# EasyEDA Pro project EasyEDA_Pro_SMD_3128_BM_3.epro, board CPLD_Cart_PCB
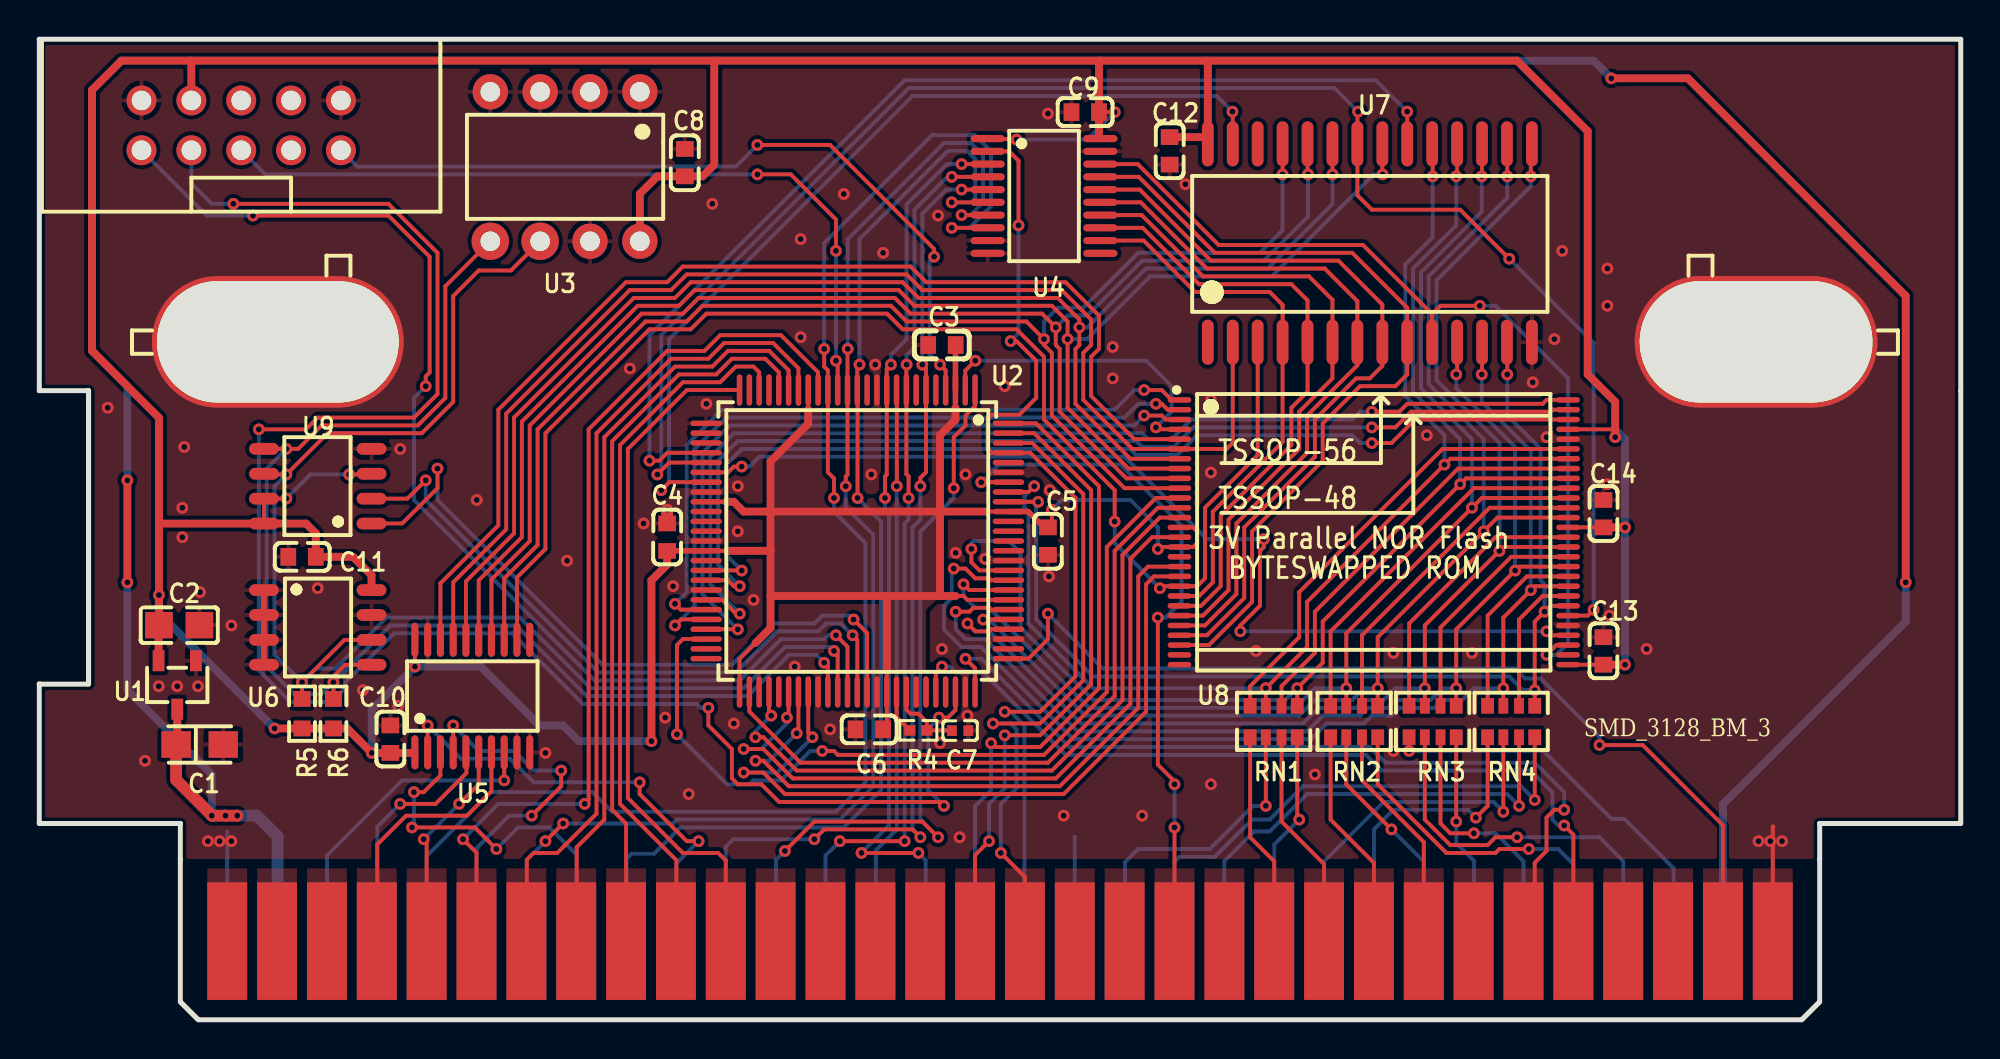
[diagram p1: board, top side]
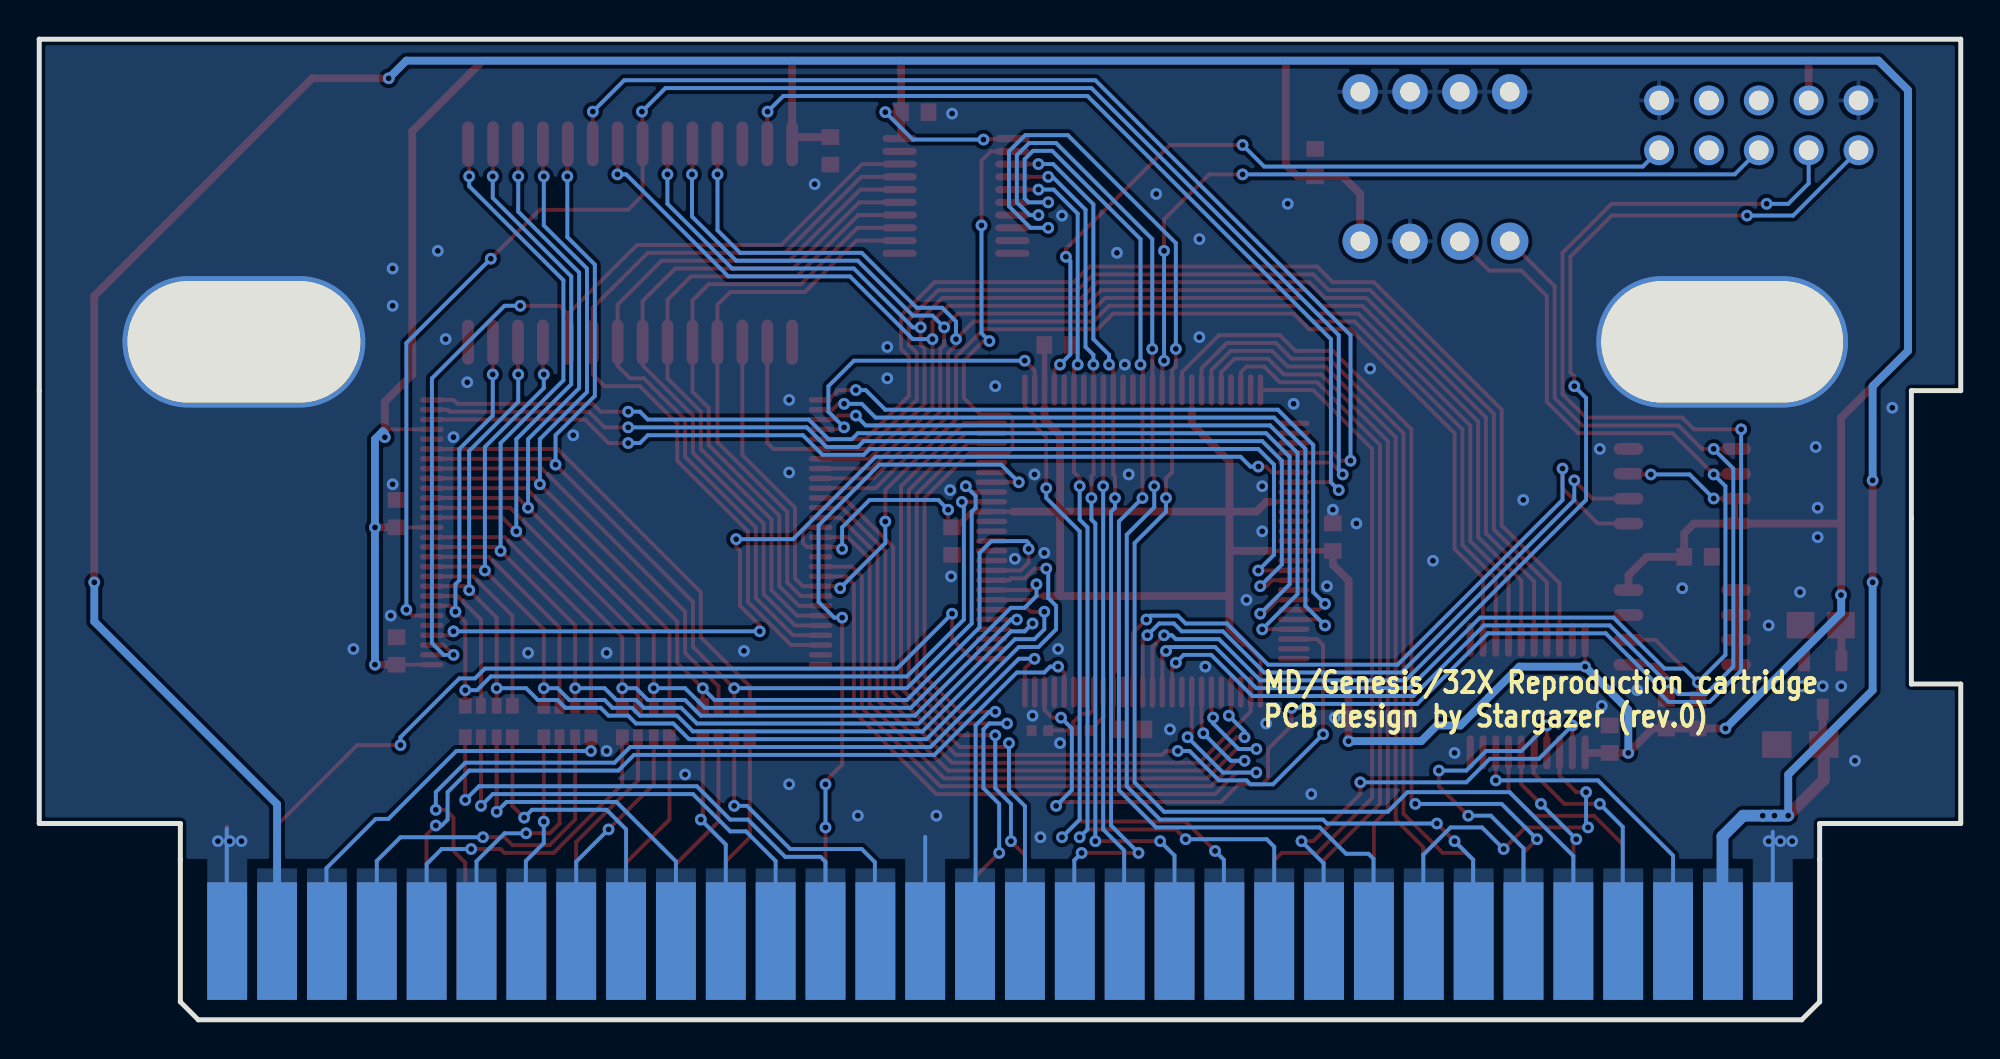
[diagram p2: board, bottom side, seen from below]

Outline 97.89 x 50 mm; copper layers: Top Layer, Bottom Layer. Coordinates in mm from the lower left corner of the outline.
Outline path: 7.19,8.18 7.19,10.01 0,10.01 0,17.12 2.51,17.12 2.51,32.08 0,32.08 0,50 97.89,50 97.89,10.01 90.7,10.01 90.7,8.18
Stack: Top Layer 0.035mm / Dielectric1 1.51mm FR4 er 4.5 / Bottom Layer 0.035mm

## Design rules (mm)
template: Custom Config
spacing copperThickness1oz (default): track to track 0.102, other pairs 0.152 to 0.3
spacing copperThickness2oz: track to track 0.203, other pairs 0.152 to 0.3
track width copperThickness1oz (default): min 0.127, default 0.254, max 2.54
track width copperThickness2oz: min 0.203, default 0.254, max 2.54
differential pair differentialPair (default): width min 0.127, default 0.254, max 2.54; gap min 0.152, default 0.152
via viaSize (default): diameter min 0.5, default 0.61, max 10; hole min 0.3, default 0.305, max 6.3
pour e3051 uses copperRegion

## Placement (name value [footprint] x y rotation side)
C1  10uF  [CASE-A_3216]  8.17 14.04 0 top
C2  1uF  [C0805]  7.13 20.12 180 top
C3  100nF  [C0603]  45.99 34.41 0 top
C4  100nF  [C0603]  31.99 24.61 270 top
C5  100nF  [C0603]  51.39 24.41 90 top
C6  100nF  [C0603]  42.29 14.81 0 top
C7  220pF  [C0402]  46.91 14.75 180 top
C8  100nF  [C0603]  32.89 43.71 90 top
C9  100nF  [C0603]  53.29 46.28 0 top
C10  100nF  [C0603]  17.89 14.31 270 top
C11  100nF  [C0603]  13.39 23.61 180 top
C12  100nF  [C0603]  57.59 44.31 270 top
C13  100nF  [C0603]  79.69 18.81 270 top
C14  100nF  [C0603]  79.69 25.81 270 top
CN1  JTAG  [IDC-TH_10P-P2.54_C5665]  10.29 45.61 0 top
CON1  EDGE CONNECTOR  [SEGA GENESIS CARTRIDGE EDGE CONNETOR]  7.19 8.18 0 top
NOREF  -  [Pad_e3007]  12.15 34.57 0 top
NOREF#2  -  [Pad_e3006]  87.47 34.57 0 top
R4  330Ω  [R0402]  44.79 14.76 0 top
R5  4.7kΩ  [R0603]  13.39 15.61 270 top
R6  4.7kΩ  [R0603]  14.99 15.61 270 top
RN1  100Ω  [RES-ARRAY-SMD_0603-8P-L3.2-W1.6-BL]  62.89 15.21 0 top
RN2  100Ω  [RES-ARRAY-SMD_0603-8P-L3.2-W1.6-BL]  66.99 15.21 0 top
RN3  100Ω  [RES-ARRAY-SMD_0603-8P-L3.2-W1.6-BL]  70.99 15.21 0 top
RN4  100Ω  [RES-ARRAY-SMD_0603-8P-L3.2-W1.6-BL]  74.99 15.21 0 top
U1  XC6206P332MR  [SOT-23-3_L2.9-W1.6-P1.90-LS2.8-BR]  7.03 17.07 90 top
U2  EPM3128ATC100  [TQFP-100_L14.0-W14.0-P0.50-LS16.0-BL]  41.68 24.41 180 top
U3  24CXX (DIP)  [PDIP-8_L9.6-W6.4-P2.54-LS7.6-BL]  26.79 43.51 180 top
U4  74LVC245  [TSSOP-20_L6.5-W4.4-P0.65-LS6.4-BL]  51.19 42.01 270 top
U5  74LVC245  [TSSOP-20_L6.5-W4.4-P0.65-LS6.4-BL]  22.06 16.51 0 top
U6  24C(SO)  [SOIC-8_L5.0-W4.0-P1.27-LS6.0-TL]  14.19 20.01 0 top
U7  FM16W08  [SOIC-28_L18.0-W7.5-P1.27-LS10.3-BL]  67.79 39.61 0 top
U8  S29GL01GT10TFI020  [TSOP-56_L14.1-W18.5-P0.50-LS20.2-BL]  67.99 24.86 270 top
U9  M95XXX  [SOIC-8_L5.0-W4.0-P1.27-LS6.0-TL]  14.19 27.21 180 top

## Footprints (pads in the part's own frame, mm; a bottom-side part is the same pattern mirrored in y, then rotated)
C0402
  rect 0.5x0.54 smd: 1(-0.42,0) 2(0.42,0)
C0603
  rect 0.8x0.9 smd: 1(-0.7,0) 2(0.7,0)
C0805
  rect 1.41x1.35 smd: 1(-1.03,0) 2(1.03,0)
CASE-A_3216
  rect 1.5x1.359 smd: 1(-1.2,0) 2(1.2,0)
IDC-TH_10P-P2.54_C5665
  round 1.524 hole 1: 1(-5.08,-1.27) 2(-5.08,1.27) 3(-2.54,-1.27) 4(-2.54,1.27) 5(0,-1.27) 6(0,1.27) 7(2.54,-1.27) 8(2.54,1.27) 9(5.08,-1.27) 10(5.08,1.27)
Pad_e3006
  oval 12.37x6.705 hole 11.862x6.197: 2(0,0)
Pad_e3007
  oval 12.827x6.705 hole 12.319x6.197: 2(0,0)
PDIP-8_L9.6-W6.4-P2.54-LS7.6-BL
  round 1.8 hole 1: 1(-3.81,-3.81) 2(-1.27,-3.81) 3(1.27,-3.81) 4(3.81,-3.81) 7(-1.27,3.81) 8(-3.81,3.81)
  round 1.905 hole 1: 5(3.81,3.81) 6(1.27,3.81)
R0402
  rect 0.566x0.54 smd: 1(-0.433,0) 2(0.433,0)
R0603
  rect 0.806x0.864 smd: 1(-0.753,0) 2(0.753,0)
RES-ARRAY-SMD_0603-8P-L3.2-W1.6-BL
  rect 0.65x0.8 smd: 1(-1.2,-0.8) 4(1.2,-0.8) 5(1.2,0.8) 8(-1.2,0.8)
  rect 0.5x0.8 smd: 2(-0.4,-0.8) 3(0.4,-0.8) 6(0.4,0.8) 7(-0.4,0.8)
SEGA GENESIS CARTRIDGE EDGE CONNETOR
  custom 2.032x5.995 smd far side: A1(2.388,-3.81) A2(4.928,-3.81) A3(7.468,-3.81) A4(10.008,-3.81) A5(12.547,-3.81) A6(15.088,-3.81) A7(17.628,-3.81) A8(20.168,-3.81) A9(22.707,-3.81) A10(25.247,-3.81) A11(27.788,-3.81) A12(30.328,-3.81) A13(32.867,-3.81) A14(35.407,-3.81) A15(37.947,-3.81) A16(40.487,-3.81) A17(43.028,-3.81) A18(45.568,-3.81) A19(48.108,-3.81) A20(50.648,-3.81) A21(53.188,-3.81) A22(55.727,-3.81) A23(58.267,-3.81) A24(60.807,-3.81) A25(63.347,-3.81) A26(65.888,-3.81) A27(68.427,-3.81) A28(70.968,-3.81) A29(73.507,-3.81) A30(76.047,-3.81) A31(78.588,-3.81) A32(81.127,-3.81)
  custom 2.032x5.995 smd: B1(2.388,-3.81) B2(4.928,-3.81) B3(7.468,-3.81) B4(10.008,-3.81) B5(12.547,-3.81) B6(15.088,-3.81) B7(17.628,-3.81) B8(20.168,-3.81) B9(22.707,-3.81) B10(25.247,-3.81) B11(27.788,-3.81) B12(30.328,-3.81) B13(32.867,-3.81) B14(35.407,-3.81) B15(37.947,-3.81) B16(40.487,-3.81) B17(43.028,-3.81) B18(45.568,-3.81) B19(48.108,-3.81) B20(50.648,-3.81) B21(53.188,-3.81) B22(55.727,-3.81) B23(58.267,-3.81) B24(60.807,-3.81) B25(63.347,-3.81) B26(65.888,-3.81) B27(68.427,-3.81) B28(70.968,-3.81) B29(73.507,-3.81) B30(76.047,-3.81) B31(78.588,-3.81) B32(81.127,-3.81)
SOIC-8_L5.0-W4.0-P1.27-LS6.0-TL
  oval 1.52x0.6 smd: 1(-2.74,1.905) 2(-2.74,0.635) 3(-2.74,-0.635) 4(-2.74,-1.905) 5(2.74,-1.905) 6(2.74,-0.635) 7(2.74,0.635) 8(2.74,1.905)
SOIC-28_L18.0-W7.5-P1.27-LS10.3-BL
  oval 0.6x2.3 smd: 1(-8.255,-5.058) 2(-6.985,-5.058) 3(-5.715,-5.058) 4(-4.445,-5.058) 5(-3.175,-5.058) 6(-1.905,-5.058) 7(-0.635,-5.058) 8(0.635,-5.058) 9(1.905,-5.058) 10(3.175,-5.058) 11(4.445,-5.058) 12(5.715,-5.058) 13(6.985,-5.058) 14(8.255,-5.058) 15(8.255,5.058) 16(6.985,5.058) 17(5.715,5.058) 18(4.445,5.058) 19(3.175,5.058) 20(1.905,5.058) 21(0.635,5.058) 22(-0.635,5.058) 23(-1.905,5.058) 24(-3.175,5.058) 25(-4.445,5.058) 26(-5.715,5.058) 27(-6.985,5.058) 28(-8.255,5.058)
SOT-23-3_L2.9-W1.6-P1.90-LS2.8-BR
  rect 1.07x0.6 smd: 1(1.235,-0.95) 2(1.235,0.95) 3(-1.235,0)
TQFP-100_L14.0-W14.0-P0.50-LS16.0-BL
  oval 0.28x1.6 smd: 1(-6,-7.7) 2(-5.5,-7.7) 3(-5,-7.7) 4(-4.5,-7.7) 5(-4,-7.7) 6(-3.5,-7.7) 7(-3,-7.7) 8(-2.5,-7.7) 9(-2,-7.7) 10(-1.5,-7.7) 11(-1,-7.7) 12(-0.5,-7.7) 13(0,-7.7) 14(0.5,-7.7) 15(1,-7.7) 16(1.5,-7.7) 17(2,-7.7) 18(2.5,-7.7) 19(3,-7.7) 20(3.5,-7.7) 21(4,-7.7) 22(4.5,-7.7) 23(5,-7.7) 24(5.5,-7.7) 25(6,-7.7) 51(6,7.7) 52(5.5,7.7) 53(5,7.7) 54(4.5,7.7) 55(4,7.7) 56(3.5,7.7) 57(3,7.7) 58(2.5,7.7) 59(2,7.7) 60(1.5,7.7) 61(1,7.7) 62(0.5,7.7) 63(0,7.7) 64(-0.5,7.7) 65(-1,7.7) 66(-1.5,7.7) 67(-2,7.7) 68(-2.5,7.7) 69(-3,7.7) 70(-3.5,7.7) 71(-4,7.7) 72(-4.5,7.7) 73(-5,7.7) 74(-5.5,7.7) 75(-6,7.7)
  oval 1.6x0.28 smd: 26(7.7,-6) 27(7.7,-5.5) 28(7.7,-5) 29(7.7,-4.5) 30(7.7,-4) 31(7.7,-3.5) 32(7.7,-3) 33(7.7,-2.5) 34(7.7,-2) 35(7.7,-1.5) 36(7.7,-1) 37(7.7,-0.5) 38(7.7,0) 39(7.7,0.5) 40(7.7,1) 41(7.7,1.5) 42(7.7,2) 43(7.7,2.5) 44(7.7,3) 45(7.7,3.5) 46(7.7,4) 47(7.7,4.5) 48(7.7,5) 49(7.7,5.5) 50(7.7,6) 76(-7.7,6) 77(-7.7,5.5) 78(-7.7,5) 79(-7.7,4.5) 80(-7.7,4) 81(-7.7,3.5) 82(-7.7,3) 83(-7.7,2.5) 84(-7.7,2) 85(-7.7,1.5) 86(-7.7,1) 87(-7.7,0.5) 88(-7.7,0) 89(-7.7,-0.5) 90(-7.7,-1) 91(-7.7,-1.5) 92(-7.7,-2) 93(-7.7,-2.5) 94(-7.7,-3) 95(-7.7,-3.5) 96(-7.7,-4) 97(-7.7,-4.5) 98(-7.7,-5) 99(-7.7,-5.5) 100(-7.7,-6)
TSOP-56_L14.1-W18.5-P0.50-LS20.2-BL
  oval 0.28x1.2 smd: 1(-6.75,-9.9) 2(-6.25,-9.9) 3(-5.75,-9.9) 4(-5.25,-9.9) 5(-4.75,-9.9) 6(-4.25,-9.9) 7(-3.75,-9.9) 8(-3.25,-9.9) 9(-2.75,-9.9) 10(-2.25,-9.9) 11(-1.75,-9.9) 12(-1.25,-9.9) 13(-0.75,-9.9) 14(-0.25,-9.9) 15(0.25,-9.9) 16(0.75,-9.9) 17(1.25,-9.9) 18(1.75,-9.9) 19(2.25,-9.9) 20(2.75,-9.9) 21(3.25,-9.9) 22(3.75,-9.9) 23(4.25,-9.9) 24(4.75,-9.9) 25(5.25,-9.9) 26(5.75,-9.9) 27(6.25,-9.9) 28(6.75,-9.9) 29(6.75,9.9) 30(6.25,9.9) 31(5.75,9.9) 32(5.25,9.9) 33(4.75,9.9) 34(4.25,9.9) 35(3.75,9.9) 36(3.25,9.9) 37(2.75,9.9) 38(2.25,9.9) 39(1.75,9.9) 40(1.25,9.9) 41(0.75,9.9) 42(0.25,9.9) 43(-0.25,9.9) 44(-0.75,9.9) 45(-1.25,9.9) 46(-1.75,9.9) 47(-2.25,9.9) 48(-2.75,9.9) 49(-3.25,9.9) 50(-3.75,9.9) 51(-4.25,9.9) 52(-4.75,9.9) 53(-5.25,9.9) 54(-5.75,9.9) 55(-6.25,9.9) 56(-6.75,9.9)
TSSOP-20_L6.5-W4.4-P0.65-LS6.4-BL
  oval 0.364x1.742 smd: 1(-2.925,-2.871) 2(-2.275,-2.871) 3(-1.625,-2.871) 4(-0.975,-2.871) 5(-0.325,-2.871) 6(0.325,-2.871) 7(0.975,-2.871) 8(1.625,-2.871) 9(2.275,-2.871) 10(2.925,-2.871) 11(2.925,2.871) 12(2.275,2.871) 13(1.625,2.871) 14(0.975,2.871) 15(0.325,2.871) 16(-0.325,2.871) 17(-0.975,2.871) 18(-1.625,2.871) 19(-2.275,2.871) 20(-2.925,2.871)

## Nets
As in the schematic, except:
GND: C1.2 C2.1 C3.1 C4.1 C5.1 C6.1 C7.1 C8.2 C9.1 C10.1 C11.2 C12.2 C13.1 C14.1 CN1.2 CN1.10 CON1.A1 CON1.A18 CON1.A32 CON1.B32 NOREF.2 NOREF#2.2 U1.1 U2.11 U2.26 U2.33 U2.38 U2.43 U2.53 U2.59 U2.65 U2.74 U2.78 U2.86 U2.95 U3.1 U3.2 U3.3 U3.4 U3.7 U4.9 U4.10 U4.19 U5.9 U5.10 U5.19 U6.1 U6.2 U6.3 U6.4 U6.7 U7.14 U8.33 U8.52 U9.4

Pads without a net: CN1 6 7 8; CON1 B1 B2 B3 B12 B13 B14 B15 B18 B19 B21 B26 B29 B30; U2 5 7 12 22 24 27 28 35 36 37 40 49 50 55 69 70 72 77 87 88 89 90 96; U4 11; U5 11; U7 1 26; U8 17 27 28 30

## Via types
v1: diameter 0.6, hole 0.3, Top Layer to Bottom Layer, 278 vias

## Routing (per net, layer and track width the routed paths; a pad name or vN(x,y) marks a point on that pad's centre or on a via; arc(x,y) is an arc through that point)
+3V3: length 330
  Top Layer w0.2: U2.82 47.28,21.41 47.09,21.61 46.69,21.61 ; U9.3 16.89,27.81 v1(15.79,27.81) ; v1(49.79,44.88) 49.76,44.91 48.32,44.91 ; 35.04,23.91 U2.39 ; C6.2 43.18,15 U2.66 43.18,17.8 ; U2.51 35.68,18.4 36.49,19.21 ; U2.18 39.18,31.11 ; U8.53 80.19,30.11 80.29,30.01 ; U9.8 U9.7 12.58,26.57 v1(12.59,26.58) ; U2.91 48.29,25.91 ; v1(51.59,26.01) 51.59,25.31 C5.2 ; U8.43 C14.2 ; U8.14 58.79,25.11 58.99,24.91 58.99,24.31 58.79,24.11 U8.16 57.09,24.11 v1(56.99,24.01) ; U5.20 v1(19.14,18.01) ; 34.99,26.41 U2.34 ; U2.3 46.68,31.21 ; C9.2 v1(54.79,46.28) ; U8.29 C13.2
  Top Layer w0.28: U2.3 46.68,34.4 C3.2 ; U2.91 50.38,25.91 51.19,25.11 C5.2 ; U2.39 31.99,23.91 C4.2
  Top Layer w0.4: 46.69,21.61 45.89,21.61 ; 45.89,21.61 45.89,25.91 ; 45.89,21.61 43.18,21.61 ; 46.68,31.21 46.68,30.6 45.89,29.81 45.89,25.91 ; v1(80.29,29.71) 80.29,31.51 78.89,32.91 78.89,45.31 75.29,48.91 59.53,48.91 ; v1(31.19,14.21) 31.19,22.41 31.99,23.21 C4.2 ; v1(80.79,18.11) C13.2 ; C12.1 59.53,45.01 ; 59.53,45.01 59.53,48.91 ; 59.53,45.01 U7.28 ; 37.26,21.61 37.26,23.91 ; 37.26,21.61 37.26,19.98 36.49,19.21 ; 37.26,21.61 43.18,21.61 ; 37.26,23.91 37.26,25.91 ; 37.26,23.91 35.04,23.91 ; 7.75,48.91 CN1.4 ; 7.75,48.91 4.19,48.91 2.69,47.41 2.69,34.11 6.1,30.7 6.1,25.3 ; 7.75,48.91 34.39,48.91 ; 59.53,48.91 53.99,48.91 ; 45.89,25.91 48.29,25.91 ; 45.89,25.91 37.26,25.91 ; 6.1,25.3 v1(6.1,21.66) C2.2 ; 6.1,25.3 U9.8 13.59,25.3 14.09,24.81 C11.1 15.99,23.61 16.93,22.67 U6.8 ; 37.26,25.91 35.88,25.91 35.38,26.41 34.99,26.41 ; 37.26,25.91 37.26,28.48 39.18,30.4 39.18,31.11 ; 34.39,48.91 53.99,48.91 ; 34.39,48.91 34.39,43.61 33.79,43.01 C8.1 31.49,43.01 30.6,42.12 U3.8 ; 53.99,48.91 C9.2 53.99,44.98 ; v1(80.79,25.11) C14.2 ; 43.18,21.61 43.18,17.8 ; 19.11,13.61 C10.2 v1(16.94,13.61) 15.69,14.85 R6.2 R5.2 v1(11.99,14.85)
  Top Layer w0.406: C2.2 6.08,20.1 U1.2
  Bottom Layer w0.2: v1(54.79,46.28) 53.39,44.88 v1(49.79,44.88) ; v1(12.59,26.58) 13.81,27.81 v1(15.79,27.81) ; v1(51.59,26.01) 52.09,26.51 55.59,26.51 56.99,25.11 v1(56.99,24.01)
  Bottom Layer w0.4: v1(16.94,13.61) 16.94,15.81 v1(19.14,18.01) 22.49,18.01 25.49,15.01 26.69,15.01 27.49,14.21 v1(31.19,14.21) ; v1(80.29,29.71) 80.29,29.91 80.39,30.01 80.79,29.61 v1(80.79,25.11) v1(80.79,18.11) ; v1(11.99,14.85) 6.09,20.75 6.09,21.71
+5V: length 190.1
  Top Layer w0.4: v1(4.49,27.51) v1(4.49,22.31) ; v1(80.09,48.01) 83.99,48.01 95.09,36.91 v1(95.09,22.31)
  Top Layer w0.406: U1.3 7.03,14.09 6.97,14.04
  Top Layer w0.6: 6.97,14.04 6.97,12.24 8.8,10.41 v1(9.49,10.41) v1(10.09,10.41)
  Bottom Layer w0.4: v1(4.49,27.51) 4.49,32.31 2.69,34.11 2.69,47.41 4.19,48.91 79.19,48.91 v1(80.09,48.01) ; CON1.A31 85.78,11 95.09,20.31 v1(95.09,22.31) ; v1(8.79,10.41) 8.79,12.51 4.49,16.81 v1(4.49,22.31)
  Bottom Layer w0.6: 8.88,10.41 v1(9.49,10.41) v1(10.09,10.41) 11.09,10.41 12.14,9.35 12.14,4.39 CON1.A2
GND: length 25.6
  Top Layer w0.203: CON1.A32 88.32,9.84 88.34,9.86
  Top Layer w0.3: U6.1 U6.2 U6.3 U6.4
  Top Layer w0.6: v1(31.99,26.01) C4.1
  Bottom Layer w0.2: CON1.A18 52.76,9.33
  Bottom Layer w0.203: CON1.A32 88.34,4.39 88.34,9.74 ; CON1.A1 9.58,9.58
  vias: v1(3.49,31.21) v1(5.39,13.21) v1(6.09,17.01) v1(7.03,17.01) v1(7.29,26.11) v1(7.29,24.61) v1(7.39,29.21) v1(8.09,17.01) v1(8.19,21.81) v1(8.59,9.11) v1(9.19,9.11) v1(9.79,20.11) v1(9.79,9.11) v1(14.19,22.01) v1(16.49,16.81) v1(18.29,16.01) v1(18.39,29.11) v1(22.29,26.51) v1(25.79,13.61) v1(26.89,23.41) v1(30.09,33.21) v1(30.79,25.31) v1(31.89,15.41) v1(32.29,22.11) v1(33.09,11.51) v1(33.99,31.41) v1(34.29,41.61) v1(35.39,15.11) v1(35.59,27.21) v1(35.59,24.91) v1(36.39,21.41) v1(38.49,18.01) v1(38.79,39.81) v1(38.79,34.81) v1(40.29,14.81) v1(40.99,42.11) v1(42.39,27.81) v1(42.59,33.41) v1(42.99,39.11) v1(45.79,41.01) v1(45.89,14.11) v1(45.99,18.91) v1(46.69,23.81) v1(46.89,9.31) v1(47.19,27.81) v1(47.29,15.51) v1(48.19,23.51) v1(49.19,32.31) v1(51.39,46.21) v1(51.44,22.61) v1(51.49,27.01) v1(52.19,10.41) v1(54.69,34.31) v1(54.69,32.71) v1(56.19,10.41) v1(58.39,42.61) v1(59.69,31.61) v1(59.69,27.91) v1(59.69,12.01) v1(61.99,18.81) v1(64.99,12.51) v1(68.99,18.71) v1(68.99,13.71) v1(70.69,29.81) v1(72.99,18.71) v1(76.09,32.51) v1(76.79,29.71) v1(77.19,34.71) v1(77.59,39.21) v1(79.89,38.31) v1(79.89,36.41) v1(79.89,27.31) v1(79.99,20.61) v1(81.89,18.91) v1(87.59,9.11) v1(88.19,9.11) v1(88.79,9.11)
A1: length 46.3
  Top Layer w0.2: 70.96,35.98 U7.10 ; 70.96,35.98 67.44,39.51 60.09,39.51 55.96,43.63 U4.18 ; 70.96,35.98 71.39,36.41 v1(73.39,36.41) ; U8.31 77.29,19.11 v1(76.79,18.61)
  Bottom Layer w0.2: v1(76.79,18.61) 77.29,18.61 77.89,19.21 77.89,32.71 74.19,36.41 v1(73.39,36.41)
A2: length 42.3
  Top Layer w0.2: U8.26 59.59,19.11 61.79,21.31 61.79,24.91 65.39,28.51 65.39,30.41 67.29,32.31 69.09,32.31 69.69,32.91 U7.9
  Top Layer w0.203: U7.9 69.69,36.3 66.89,39.11 59.89,39.11 56.01,42.98 U4.17
A3: length 39.2
  Top Layer w0.2: U7.8 68.42,33.34 67.79,32.71 67.09,32.71 64.99,30.61 64.99,28.71 61.39,25.11 61.39,21.51 59.49,19.61 U8.25
  Top Layer w0.203: U4.16 56.06,42.33 59.69,38.71 66.19,38.71 68.42,36.47 U7.8
A4: length 36.2
  Top Layer w0.2: U7.7 67.15,33.37 64.59,30.81 64.59,28.91 60.99,25.31 60.99,21.71 59.39,20.11 U8.24
  Top Layer w0.203: U4.15 56.11,41.68 59.49,38.31 65.49,38.31 67.15,36.64 U7.7
A5: length 33.7
  Top Layer w0.2: U8.23 59.29,20.61 60.59,21.91 60.59,25.51 64.19,29.11 64.19,31.01 65.88,32.7 U7.6
  Top Layer w0.203: U7.6 65.88,36.71 64.69,37.91 59.29,37.91 56.16,41.03 U4.14
A6: length 31
  Top Layer w0.2: U7.5 64.61,32.03 63.79,31.21 63.79,29.31 60.19,25.71 60.19,22.11 59.19,21.11 U8.22
  Top Layer w0.203: U4.13 56.21,40.38 59.09,37.51 63.79,37.51 64.61,36.68 U7.5
A7: length 28.3
  Top Layer w0.2: 63.34,36.45 62.69,37.11 58.89,37.11 56.26,39.73 U4.12 ; U8.21 59.09,21.61 59.79,22.31 59.79,25.91 63.34,29.46 U7.4
  Top Layer w0.203: 63.34,36.45 U7.4
A8: length 69.9
  Top Layer w0.2: U5.12 24.34,22.56 25.79,24.01 25.79,29.91 31.09,35.21 33.19,35.21 33.99,36.01 43.19,36.01 43.99,35.21 49.79,35.21 51.19,33.81 51.19,30.61 54.79,27.01 v1(54.79,25.41) ; v1(57.09,22.01) 57.19,22.11 U8.20 58.99,22.11 59.39,22.51 59.39,26.11 62.07,28.79 U7.3
  Bottom Layer w0.2: v1(57.09,22.01) 54.79,24.31 v1(54.79,25.41)
A9: length 72
  Top Layer w0.2: U7.25 63.34,43.11 v1(63.34,43.11) ; U8.10 55.29,27.11 51.59,30.81 51.59,34.01 51.19,34.41 v1(51.19,34.71) 50.29,35.61 44.19,35.61 43.39,36.41 33.79,36.41 32.99,35.61 30.89,35.61 25.39,30.11 25.39,24.21 23.69,22.51 U5.13
  Bottom Layer w0.2: v1(63.34,43.11) 63.34,40.26 62.19,39.11 55.99,39.11 53.19,36.31 51.89,36.31 51.19,35.61 v1(51.19,34.71)
A10: length 72.6
  Top Layer w0.2: v1(64.64,43.11) 64.61,43.13 U7.24 ; U5.14 23.04,22.46 24.99,24.41 24.99,30.31 30.69,36.01 32.79,36.01 33.59,36.81 43.59,36.81 44.39,36.01 51.09,36.01 v1(51.79,35.31) 51.79,34.41 51.99,34.21 51.99,31.01 55.39,27.61 U8.9
  Bottom Layer w0.2: v1(64.64,43.11) 64.64,40.96 62.39,38.71 56.19,38.71 53.39,35.91 52.39,35.91 v1(51.79,35.31)
A11: length 75.8
  Top Layer w0.2: U7.21 68.42,43.12 v1(68.44,43.11) ; U5.15 22.39,22.41 24.59,24.61 24.59,30.51 30.49,36.41 32.59,36.41 33.39,37.21 43.79,37.21 44.59,36.41 51.59,36.41 52.39,35.61 v1(52.39,34.71) 52.39,31.21 55.49,28.11 U8.8
  Bottom Layer w0.2: v1(68.44,43.11) 67.99,43.11 62.79,37.91 56.59,37.91 53.39,34.71 v1(52.39,34.71)
A12: length 74.2
  Top Layer w0.2: U8.7 55.59,28.61 52.79,31.41 52.79,34.21 52.99,34.41 v1(52.99,35.31) 52.99,35.71 51.89,36.81 44.79,36.81 43.99,37.61 33.19,37.61 32.39,36.81 30.29,36.81 24.19,30.71 24.19,24.81 21.74,22.36 U5.16 ; v1(65.89,43.11) 65.88,43.11 U7.23
  Bottom Layer w0.2: v1(52.99,35.31) 53.39,35.31 56.39,38.31 62.59,38.31 65.89,41.61 v1(65.89,43.11)
A13: length 64.5
  Top Layer w0.2: U5.17 21.09,22.31 23.79,25.01 23.79,30.91 30.09,37.21 32.19,37.21 32.99,38.01 44.19,38.01 44.99,37.21 52.09,37.21 53.59,35.71 53.59,34.41 53.19,34.01 53.19,31.61 55.69,29.11 U8.6 60.49,29.11 60.8,29.42 U7.2
A14: length 57.3
  Top Layer w0.2: U5.18 20.44,22.26 23.39,25.21 23.39,31.11 29.89,37.61 31.99,37.61 32.79,38.41 44.39,38.41 45.19,37.61 52.29,37.61 53.99,35.91 53.99,34.21 53.59,33.81 53.59,31.81 55.79,29.61 U8.5
D0: length 55.3
  Top Layer w0.2: v1(50.89,26.41) 50.88,26.41 U2.92 ; RN4.5 v1(76.19,16.81) 76.19,20.31 v1(76.69,20.81) 76.99,21.11 U8.35 ; U7.13 74.79,34.54 v1(74.79,32.91)
  Bottom Layer w0.2: v1(76.19,16.81) 75.59,16.81 74.89,17.51 53.69,17.51 50.79,20.41 50.79,26.31 v1(50.89,26.41) ; v1(74.79,32.91) 74.79,30.81 76.49,29.11 76.49,22.41 76.69,22.21 v1(76.69,20.81)
D1: length 60.4
  Top Layer w0.2: U8.37 76.19,22.11 v1(75.99,21.91) 74.59,20.51 v1(74.59,16.91) RN4.7 ; U2.84 48.48,22.41 48.39,22.51 47.69,22.51 47.19,23.01 v1(46.59,23.01) ; U7.12 73.5,32.92 v1(73.49,32.91)
  Bottom Layer w0.2: v1(74.59,16.91) 73.09,16.91 72.49,16.31 71.49,16.31 71.09,15.91 69.29,15.91 68.89,15.51 67.89,15.51 67.49,15.11 65.59,15.11 64.79,14.31 52.69,14.31 47.99,19.01 46.99,19.01 46.09,19.91 46.09,21.11 46.49,21.51 46.49,22.91 v1(46.59,23.01) ; v1(73.49,32.91) 73.49,31.51 75.99,29.01 v1(75.99,21.91)
D2: length 56.1
  Top Layer w0.2: U8.39 75.39,23.11 v1(75.19,22.91) 72.19,19.91 v1(72.19,16.91) RN3.5 ; v1(46.69,20.81) 47.39,20.81 47.59,21.01 48.39,21.01 48.48,20.91 U2.81 ; U7.11 72.23,32.95 v1(72.19,32.91)
  Bottom Layer w0.2: v1(72.19,32.91) 72.19,32.21 75.19,29.21 v1(75.19,22.91) ; v1(72.19,16.91) 71.49,16.91 70.89,16.31 69.09,16.31 68.69,15.91 67.69,15.91 67.29,15.51 65.39,15.51 64.59,14.71 52.89,14.71 48.19,19.41 47.19,19.41 46.69,19.91 v1(46.69,20.81)
D3: length 65.6
  Top Layer w0.2: U2.79 48.49,19.91 48.39,19.81 47.69,19.81 v1(47.29,20.21) ; v1(75.99,43.01) 75.99,44.61 U7.15 ; RN3.7 v1(70.59,16.91) 70.59,20.11 v1(74.39,23.91) 74.59,24.11 U8.41
  Bottom Layer w0.2: v1(74.39,23.91) 74.39,29.41 71.19,32.61 71.19,37.71 75.99,42.51 v1(75.99,43.01) ; v1(70.59,16.91) 69.09,16.91 68.49,16.31 67.49,16.31 67.09,15.91 65.19,15.91 64.39,15.11 53.09,15.11 48.39,19.81 47.69,19.81 v1(47.29,20.21)
D4: length 62.3
  Top Layer w0.2: v1(48.09,20.41) 48.09,20.41 U2.80 ; RN2.5 v1(68.19,16.91) 68.19,19.51 v1(73.59,24.91) 74.29,25.61 U8.44 ; U7.16 74.79,44.65 v1(74.79,43.01)
  Bottom Layer w0.2: v1(68.19,16.91) 67.49,16.91 66.89,16.31 64.99,16.31 64.19,15.51 53.29,15.51 48.39,20.41 v1(48.09,20.41) ; v1(74.79,43.01) 74.79,41.91 70.79,37.91 70.79,32.41 73.59,29.61 v1(73.59,24.91)
D5: length 64.1
  Top Layer w0.2: U7.17 73.5,43.02 v1(73.49,43.01) ; U2.83 47.38,21.91 v1(47.09,22.21) ; RN2.7 v1(66.59,16.91) 66.59,19.71 v1(72.99,26.11) 73.49,26.61 U8.46
  Bottom Layer w0.2: v1(47.09,22.21) 47.09,21.61 47.69,21.01 48.39,21.01 53.49,15.91 63.99,15.91 64.99,16.91 v1(66.59,16.91) ; v1(73.49,43.01) 73.49,41.21 70.39,38.11 70.39,32.21 72.99,29.61 v1(72.99,26.11)
D6: length 65.2
  Top Layer w0.2: U8.48 72.69,27.61 v1(72.39,27.31) 65.39,20.31 65.39,18.21 v1(64.09,16.91) RN1.5 ; U2.85 47.9,22.91 47.49,23.33 v1(47.49,24.01) ; v1(72.19,43.01) 72.23,43.05 U7.18
  Bottom Layer w0.2: v1(72.19,43.01) 72.19,40.51 69.99,38.31 69.99,32.01 72.39,29.61 v1(72.39,27.31) ; v1(47.49,24.01) 47.49,24.31 47.59,24.41 49.39,24.41 49.99,23.81 49.99,20.01 53.69,16.31 63.49,16.31 v1(64.09,16.91)
D7: length 62.5
  Top Layer w0.2: v1(50.69,27.21) 50.39,26.91 U2.93 ; U8.50 71.89,28.61 v1(71.59,28.31) 64.59,21.31 64.59,19.01 v1(62.49,16.91) RN1.7 ; U7.19 70.99,44.64 v1(70.99,43.01)
  Bottom Layer w0.2: v1(71.59,28.31) 71.59,29.81 69.59,31.81 69.59,38.51 70.99,39.91 v1(70.99,43.01) ; v1(62.49,16.91) 53.69,16.91 50.39,20.21 50.39,25.91 50.19,26.11 50.19,26.71 v1(50.69,27.21)
D8: length 7.4
  Top Layer w0.2: U8.36 76.59,21.61 75.39,20.41 RN4.6
D9: length 9.5
  Top Layer w0.2: RN4.8 73.79,20.61 75.79,22.61 U8.38
D10: length 12
  Top Layer w0.2: U8.40 74.99,23.61 71.39,20.01 RN3.6
D11: length 14.1
  Top Layer w0.2: U8.42 74.19,24.61 69.79,20.21 RN3.8
D12: length 16.8
  Top Layer w0.2: U8.45 73.89,26.11 67.39,19.61 RN2.6
D13: length 18.9
  Top Layer w0.2: U8.47 73.09,27.11 65.79,19.81 RN2.8
D14: length 21.4
  Top Layer w0.2: U8.49 72.29,28.11 64.99,20.81 64.99,18.71 63.29,17.01 RN1.6
D15: length 23.6
  Top Layer w0.2: U8.51 71.49,29.11 64.19,21.81 64.19,19.51 61.69,17.01 RN1.8
FA15: length 15.9
  Top Layer w0.2: U8.4 56.99,30.11 v1(56.89,30.21) ; U2.2 47.18,33.1 v1(47.69,33.61)
  Bottom Layer w0.2: v1(56.89,30.21) 57.69,31.01 57.69,32.31 56.39,33.61 v1(47.69,33.61)
FA16: length 36.5
  Top Layer w0.2: v1(56.29,30.81) 57.19,30.81 57.39,30.61 U8.3 ; U2.47 35.58,19.91 v1(35.59,19.91)
  Bottom Layer w0.2: v1(35.59,19.91) 33.79,21.71 33.79,28.91 35.19,30.31 55.79,30.31 v1(56.29,30.81)
FA17: length 52
  Top Layer w0.2: U2.41 35.78,22.91 v1(35.79,22.91) ; v1(67.89,29.41) 68.89,29.41 70.09,30.61 U8.54
  Bottom Layer w0.2: v1(35.79,22.91) 34.99,23.71 34.99,28.31 35.79,29.11 55.59,29.11 55.89,28.81 57.99,28.81 58.99,29.81 66.89,29.81 67.29,29.41 v1(67.89,29.41)
FA18: length 37.7
  Top Layer w0.2: v1(39.39,14.41) 39.18,14.62 U2.58 ; U8.19 56.79,22.61 56.39,22.21 56.39,15.71 52.19,11.51 37.99,11.51 36.89,12.61 v1(35.89,12.61)
  Bottom Layer w0.2: v1(39.39,14.41) 37.59,12.61 v1(35.89,12.61)
FA19: length 35.5
  Top Layer w0.2: v1(36.49,13.21) 36.89,13.21 38.19,11.91 51.99,11.91 55.99,15.91 55.99,22.61 56.49,23.11 U8.18 ; v1(38.59,14.61) 38.68,14.7 U2.57
  Bottom Layer w0.2: v1(38.59,14.61) 37.19,13.21 v1(36.49,13.21)
FA20: length 43.4
  Top Layer w0.2: v1(39.89,13.71) 40.49,13.71 40.69,13.51 51.19,13.51 54.39,16.71 54.39,24.11 56.89,26.61 U8.11 ; U2.48 32.79,19.41 32.49,19.11 v1(32.49,14.56)
  Bottom Layer w0.2: v1(32.49,14.56) 35.04,12.01 36.19,12.01 36.39,12.21 37.79,12.21 39.29,13.71 v1(39.89,13.71)
FA21: length 33.7
  Top Layer w0.2: U8.12 56.99,26.11 54.79,23.91 54.79,16.51 51.39,13.11 38.79,13.11 36.18,15.72 U2.52
FA22: length 36.6
  Top Layer w0.2: U2.56 38.18,15.5 v1(38.09,15.41) ; U8.15 56.69,24.61 55.59,23.51 55.59,16.11 51.79,12.31 38.39,12.31 36.89,13.81 v1(35.89,13.81)
  Bottom Layer w0.2: v1(38.09,15.41) 38.09,15.11 36.79,13.81 v1(35.89,13.81)
FA23: length 36.9
  Top Layer w0.2: v1(32.39,20.11) 32.69,20.41 U2.46 ; U8.2 57.49,31.11 57.19,31.41 v1(56.89,31.41)
  Bottom Layer w0.2: v1(32.39,20.11) 33.39,21.11 33.39,29.11 34.99,30.71 55.29,30.71 55.99,31.41 v1(56.89,31.41)
FA24: length 36.5
  Top Layer w0.2: U8.1 57.69,31.61 57.19,32.11 v1(56.29,32.11) ; U2.45 32.68,20.91 v1(32.39,21.21)
  Bottom Layer w0.2: v1(56.29,32.11) 55.79,32.11 54.79,31.11 34.79,31.11 32.99,29.31 32.99,21.81 v1(32.39,21.21)
FA25: length 55.8
  Top Layer w0.2: v1(35.69,20.71) 35.49,20.71 34.78,21.41 U2.44 ; U8.56 76.79,31.61 76.59,31.41 69.69,31.41 69.29,31.01 v1(67.89,31.01)
  Bottom Layer w0.2: v1(67.89,31.01) 67.29,31.01 66.89,30.61 58.69,30.61 57.69,29.61 56.49,29.61 56.19,29.91 35.39,29.91 34.19,28.71 34.19,22.21 v1(35.69,20.71)
FA26: length 53.3
  Top Layer w0.2: v1(35.69,22.11) 35.39,22.11 35.08,22.41 U2.42 ; U8.55 77.09,31.11 76.99,31.01 69.89,31.01 69.09,30.21 v1(67.89,30.21)
  Bottom Layer w0.2: v1(35.69,22.11) 34.59,23.21 34.59,28.51 35.59,29.51 55.89,29.51 56.19,29.21 57.79,29.21 58.79,30.21 v1(67.89,30.21)
SE_CLK_SCL: length 72
  Top Layer w0.2: U2.61 40.68,18.62 v1(40.49,18.81) ; U6.6 15.55,19.37 v1(13.39,17.21) R5.1 ; U3.6 24.03,38.21 22.39,38.21 21.09,36.91 21.09,31.51 19.49,29.91 14.69,29.91 v1(12.59,27.81) 11.48,27.81 U9.6
  Bottom Layer w0.2: v1(40.49,18.81) 40.29,19.01 37.99,19.01 35.89,16.91 28.09,16.91 24.49,20.51 17.69,20.51 15.09,17.91 14.09,17.91 v1(13.39,17.21) 11.99,18.61 11.99,27.21 v1(12.59,27.81)
SE_DIN_SDA: length 68.6
  Top Layer w0.2: U3.5 20.69,37.41 20.69,31.71 19.29,30.31 14.39,30.31 13.19,29.11 U9.5 ; R6.1 v1(14.99,17.21) 14.99,17.51 15.58,18.1 U6.5 ; U2.60 40.18,18.02 v1(39.99,18.21)
  Bottom Layer w0.2: v1(39.99,18.21) 39.59,18.61 38.19,18.61 36.09,16.51 27.89,16.51 24.29,20.11 17.89,20.11 v1(14.99,17.21) 14.39,16.61 12.99,16.61 11.59,18.01 11.59,28.11 12.59,29.11
  vias: v1(12.59,29.11)
SE_DOUT: length 33.8
  Top Layer w0.2: v1(19.69,27.51) 18.75,26.57 U9.2 ; v1(41.44,19.61) 41.68,19.37 U2.63
  Bottom Layer w0.2: v1(41.44,19.61) 40.84,20.21 40.09,20.21 39.69,19.81 37.59,19.81 35.49,17.71 28.49,17.71 19.69,26.51 v1(19.69,27.51)
SE_~CE: length 36.5
  Top Layer w0.2: U9.1 16.93,25.31 18.49,25.31 20.29,27.11 v1(20.29,28.11) ; v1(41.49,20.41) 42.18,19.72 U2.64
  Bottom Layer w0.2: v1(20.29,28.11) 20.29,26.51 28.69,18.11 35.29,18.11 37.39,20.21 39.49,20.21 39.89,20.61 41.29,20.61 v1(41.49,20.41)
TCK: length 59.1
  Top Layer w0.2: v1(19.69,32.31) 19.69,32.81 19.89,33.01 19.89,38.91 17.79,41.01 v1(10.89,41.01) ; v1(40.59,19.61) 41.18,19.02 U2.62
  Bottom Layer w0.2: v1(19.69,32.31) 19.09,31.71 19.09,26.51 28.29,17.31 35.69,17.31 37.79,19.41 39.99,19.41 40.19,19.61 v1(40.59,19.61) ; CN1.1 8.54,41.01 v1(10.89,41.01)
TDI: length 40.9
  Top Layer w0.2: 45.88,33.42 46.18,33.12 U2.4 ; v1(36.59,44.61) 40.29,44.61 45.59,39.31 v1(45.59,38.91)
  Bottom Layer w0.2: v1(45.59,38.91) 45.36,38.68 45.36,33.93 v1(45.89,33.41) ; v1(36.59,44.61) 35.49,43.51 16.2,43.51 CN1.9
TDO: length 94.3
  Top Layer w0.2: v1(45.84,15.41) 46.29,15.41 46.68,15.8 U2.73 ; v1(46.09,10.91) 45.89,11.11 37.69,11.11 36.79,12.01 35.59,12.01 35.29,12.31 35.29,13.81 34.09,15.01 v1(34.09,15.91) ; v1(11.19,30.11) 13.59,30.11 14.19,30.71 19.09,30.71 20.29,31.91 20.29,39.11 17.79,41.61 v1(9.89,41.61)
  Bottom Layer w0.2: v1(46.09,10.91) 45.29,11.71 45.29,13.48 45.29,13.48 45.29,14.86 v1(45.84,15.41) ; v1(9.89,41.61) 8.79,41.61 7.75,42.65 CN1.3 ; v1(34.09,15.91) 33.69,15.91 33.49,16.11 27.69,16.11 24.09,19.71 18.09,19.71 15.59,17.21 15.59,16.91 14.89,16.21 12.79,16.21 11.19,17.81 v1(11.19,30.11)
TMS: length 40.5
  Top Layer w0.2: v1(40.59,39.21) 40.59,40.81 38.29,43.11 v1(36.59,43.11) ; v1(40.59,33.61) 40.68,33.52 U2.15
  Bottom Layer w0.2: CN1.5 11.52,43.11 v1(36.59,43.11) ; v1(40.59,33.61) v1(40.59,39.21)
VA1: length 50.1
  Top Layer w0.2: v1(49.89,40.51) 49.89,43.81 49.41,44.28 U4.2 ; v1(49.49,34.61) 49.79,34.61 50.79,33.61 50.79,31.71 49.94,30.86 48.51,30.86 48.31,30.66 48.31,29.11 48.51,28.91 U2.97 50.48,28.91 52.79,26.61 52.79,17.51 50.99,15.71 v1(49.19,15.71)
  Bottom Layer w0.2: v1(49.49,34.61) 49.89,35.01 v1(49.89,40.51) ; CON1.A17 50.19,4.4 50.19,15.01 49.49,15.71 v1(49.19,15.71)
VA2: length 46.4
  Top Layer w0.2: v1(43.09,26.61) 43.09,27.71 43.18,27.8 U2.10 43.18,33.2 43.39,33.41 ; v1(46.99,43.63) U4.3 ; v1(41.89,8.51) v1(44.79,8.51)
  Bottom Layer w0.2: CON1.A15 45.16,4.39 45.16,8.14 v1(44.79,8.51) ; v1(43.39,33.41) 43.39,33.91 44.19,34.71 44.19,41.58 46.24,43.63 v1(46.99,43.63) ; v1(43.09,26.61) 43.09,26.11 43.29,25.91 43.29,9.91 v1(41.89,8.51)
VA3: length 45.3
  Top Layer w0.2: 44.19,33.43 44.18,33.42 44.18,32.14 ; v1(40.79,9.11) v1(44.09,9.11) ; v1(46.49,42.98) U4.4 ; U2.8 44.18,27.82 44.29,27.71 v1(44.29,26.61)
  Bottom Layer w0.2: CON1.A13 40.06,8.38 v1(40.79,9.11) ; v1(44.29,26.61) 44.29,25.51 44.09,25.31 v1(44.09,9.11) ; v1(44.19,33.41) 44.19,33.91 44.59,34.31 44.59,41.31 46.26,42.98 v1(46.49,42.98)
VA4: length 51.1
  Top Layer w0.2: v1(44.99,33.41) 45.18,33.22 U2.6 45.18,27.92 44.89,27.63 v1(44.89,27.21) ; v1(44.89,9.31) 44.49,9.71 39.99,9.71 v1(39.49,9.21) ; v1(46.99,42.33) U4.5
  Bottom Layer w0.2: v1(39.49,9.21) 35.36,9.21 34.98,8.82 CON1.A11 ; v1(44.89,27.21) 44.89,25.51 44.49,25.11 44.49,9.71 v1(44.89,9.31) ; v1(44.99,33.41) 44.99,41.11 46.21,42.33 v1(46.99,42.33)
VA5: length 60
  Top Layer w0.2: v1(41.79,33.41) 41.68,33.3 U2.13 41.69,32.1 v1(41.69,26.61) ; U4.6 v1(46.49,41.68)
  Bottom Layer w0.2: v1(41.69,26.61) 42.89,25.41 42.89,11.71 40.99,9.81 32.66,9.81 31.32,8.47 30.17,8.47 29.92,8.21 29.92,4.39 CON1.A9 ; v1(46.49,41.68) 47.49,41.68 47.69,41.88 47.69,43.88 47.26,44.31 46.29,44.31 41.79,39.81 v1(41.79,33.41)
VA6: length 65.8
  Top Layer w0.2: v1(41.09,27.21) 41.09,27.71 41.18,27.8 U2.14 41.18,34.2 v1(41.19,34.21) ; v1(25.79,9.11) v1(26.69,10.01) ; U4.7 v1(46.99,41.03)
  Bottom Layer w0.2: v1(41.19,34.21) 41.19,39.81 46.09,44.71 47.46,44.71 48.09,44.08 48.09,41.68 47.44,41.03 v1(46.99,41.03) ; v1(26.69,10.01) 32.29,10.01 32.49,10.21 40.79,10.21 42.49,11.91 42.49,24.73 41.09,26.13 v1(41.09,27.21)
  Bottom Layer w0.203: CON1.A7 24.84,4.39 24.84,8.16 v1(25.79,9.11)
VA7: length 75.3
  Top Layer w0.2: v1(39.99,34.21) 39.99,33.31 40.18,33.12 U2.16 40.18,27.92 40.49,27.61 v1(40.49,26.61) ; U4.8 v1(46.49,40.38)
  Bottom Layer w0.2: CON1.A5 19.74,8.36 22.99,11.61 28.19,11.61 29.19,10.61 40.59,10.61 42.09,12.11 42.09,24.31 40.49,25.91 v1(40.49,26.61) ; v1(46.49,40.38) 47.39,40.38 48.49,41.48 48.49,44.28 47.66,45.11 45.49,45.11 39.99,39.61 v1(39.99,34.21)
VA8: length 16.1
  Top Layer w0.2: U5.8 v1(23.69,12.21)
  Bottom Layer w0.2: v1(23.69,12.21) 18.49,12.21 14.66,8.38 CON1.A3
VA9: length 13.5
  Top Layer w0.2: U5.7 23.04,11.66 21.79,10.41 18.69,10.41 17.22,8.94 17.22,4.39 CON1.B4
VA10: length 10.5
  Top Layer w0.2: CON1.B5 19.74,9.06 v1(19.59,9.21) ; U5.6 22.39,12.01 v1(21.39,11.01)
  Bottom Layer w0.2: v1(19.59,9.21) v1(21.39,11.01)
VA11: length 12.2
  Top Layer w0.2: v1(18.39,11.01) 20.19,11.01 21.76,12.58 21.76,13.64
  Bottom Layer w0.2: v1(18.39,11.01) 17.22,9.84 17.22,4.39 CON1.A4
VA12: length 18.6
  Top Layer w0.2: v1(25.09,10.41) 26.59,11.91 v1(26.59,12.71) ; v1(21.09,15.01) U5.4
  Bottom Layer w0.2: v1(26.59,12.71) 25.19,12.71 24.19,13.71 22.39,13.71 v1(21.09,15.01) ; CON1.A6 22.28,8.74 23.94,10.41 v1(25.09,10.41)
VA13: length 18.7
  Top Layer w0.2: v1(23.29,8.71) 22.19,9.81 v1(18.99,9.81) ; U5.3 20.44,12.46 19.59,11.61 v1(19.09,11.61)
  Bottom Layer w0.2: v1(19.09,11.61) 19.09,9.91 v1(18.99,9.81) ; CON1.A8 27.38,4.39 27.38,8.42 25.99,9.81 24.39,9.81 v1(23.29,8.71)
VA14: length 23.2
  Top Layer w0.2: v1(33.59,9.11) 32.99,9.11 30.59,11.51 v1(30.59,12.11) ; v1(19.79,15.01) U5.2
  Bottom Layer w0.2: v1(19.79,15.01) 21.49,13.31 23.99,13.31 25.19,12.11 v1(30.59,12.11) ; CON1.A10 32.46,4.39 32.46,7.98 v1(33.59,9.11)
VA15: length 37.5
  Top Layer w0.2: v1(37.99,8.61) 39.49,10.11 44.99,10.11 v1(45.79,9.31) ; U2.1 47.68,31.3 47.19,30.81 47.19,30.31 46.59,29.71 v1(46.59,27.11)
  Bottom Layer w0.2: CON1.A12 37.54,4.39 37.54,8.16 v1(37.99,8.61) ; v1(46.59,27.11) 46.59,26.61 44.89,24.91 44.89,10.21 v1(45.79,9.31)
VA16: length 28.2
  Top Layer w0.2: U2.9 43.69,32.1 v1(43.69,27.21)
  Bottom Layer w0.2: v1(43.69,27.21) 43.69,9.71 42.62,8.64 42.62,4.39 CON1.A14
VA17: length 33.1
  Top Layer w0.2: v1(48.49,14.11) 48.69,13.91 50.99,13.91 53.99,16.91 53.99,27.21 50.78,30.41 U2.100
  Bottom Layer w0.2: CON1.A16 47.68,10.9 48.49,11.71 v1(48.49,14.11)
VA18: length 46.6
  Top Layer w0.2: CON1.B6 22.28,8.52 v1(21.59,9.21) ; v1(27.79,11.01) 27.99,11.21 27.99,30.11 31.99,34.11 33.89,34.11 34.69,34.91 37.79,34.91 39.68,33.02 U2.17
  Bottom Layer w0.2: v1(21.59,9.21) 23.39,11.01 v1(27.79,11.01)
VA19: length 41.6
  Top Layer w0.2: CON1.B7 24.84,4.39 24.84,8.16 25.19,8.51 26.39,8.51 28.39,10.51 28.39,29.91 32.19,33.71 34.09,33.71 34.89,34.51 37.39,34.51 38.68,33.22 U2.19
VA20: length 38.6
  Top Layer w0.2: CON1.B8 27.38,4.39 27.38,8.8 28.79,10.21 28.79,29.71 32.39,33.31 34.29,33.31 35.09,34.11 37.19,34.11 38.18,33.12 U2.20
VA21: length 36.8
  Top Layer w0.2: U2.21 37.68,33.02 36.99,33.71 35.29,33.71 34.49,32.91 32.59,32.91 29.19,29.51 29.19,10.71 29.9,10 CON1.B9
VA22: length 35.9
  Top Layer w0.2: U2.23 36.68,33.02 36.39,33.31 35.49,33.31 34.69,32.51 32.79,32.51 29.59,29.31 29.59,11.01 32.46,8.14 32.46,4.39 CON1.B10
VA23: length 34.8
  Top Layer w0.2: U2.25 32.99,32.11 29.99,29.11 29.99,11.31 32.79,8.51 34.59,8.51 34.98,8.12 CON1.B11
VD0: length 27.1
  Top Layer w0.2: RN4.4 v1(76.19,11.21)
  Bottom Layer w0.2: v1(76.19,11.21) 75.49,11.91 64.39,11.91 62.69,10.21 61.79,10.21 59.89,8.31 58.09,8.31 57.84,8.06 CON1.A20
VD1: length 18.1
  Top Layer w0.2: RN4.2 v1(74.59,10.61)
  Bottom Layer w0.2: CON1.A23 65.46,8.08 68.49,11.11 74.09,11.11 v1(74.59,10.61)
VD2: length 10.4
  Top Layer w0.2: v1(72.19,10.11) RN3.4
  Bottom Layer w0.2: v1(72.19,10.11) 72.19,9.01 73.1,8.1 73.1,4.39 CON1.A26
VD3: length 19.2
  Top Layer w0.2: v1(75.29,9.31) 74.19,9.31 73.79,8.91 71.89,8.91 70.59,10.21 RN3.2
  Bottom Layer w0.2: v1(75.29,9.31) 79.49,9.31 80.7,8.1 CON1.A29
VD4: length 17.8
  Top Layer w0.2: RN2.4 68.19,12.01 71.69,8.51 74.19,8.51 74.39,8.71 v1(75.89,8.71)
  Bottom Layer w0.2: v1(75.89,8.71) 77.39,8.71 78.16,7.94 CON1.A28
VD5: length 11.7
  Top Layer w0.2: RN2.2 66.59,12.01 v1(68.89,9.71)
  Bottom Layer w0.2: v1(68.89,9.71) 70.54,8.06 CON1.A25
VD6: length 10.6
  Top Layer w0.2: RN1.4 64.09,10.31 v1(64.19,10.21)
  Bottom Layer w0.2: v1(64.19,10.21) 62.92,8.94 CON1.A22
VD7: length 15.5
  Top Layer w0.2: RN1.2 v1(62.49,10.91)
  Bottom Layer w0.2: CON1.A19 55.32,4.39 55.32,8.04 55.99,8.71 59.63,8.71 61.83,10.91 v1(62.49,10.91)
VD8: length 23.9
  Top Layer w0.2: RN4.3 v1(75.39,10.91)
  Bottom Layer w0.2: v1(75.39,10.91) 74.79,11.51 64.59,11.51 62.69,9.61 61.89,9.61 60.38,8.1 CON1.A21
VD9: length 15.5
  Top Layer w0.2: RN4.1 73.79,10.91 v1(73.19,10.31)
  Bottom Layer w0.2: v1(73.19,10.31) 72.79,10.71 68.99,10.71 68,9.72 CON1.A24
VD10: length 13.1
  Top Layer w0.2: RN3.3 71.39,10.01 71.89,9.51 v1(73.09,9.51)
  Bottom Layer w0.2: CON1.A27 75.62,8.08 74.19,9.51 v1(73.09,9.51)
VD11: length 20
  Top Layer w0.2: RN3.1 v1(69.79,13.71)
  Bottom Layer w0.2: CON1.A30 83.26,4.39 83.26,7.73 80.75,10.24 80.1,10.24 76.64,13.71 v1(69.79,13.71)
VD12: length 11.3
  Top Layer w0.2: CON1.B25 70.54,9.06 67.39,12.21 RN2.3
VD13: length 11
  Top Layer w0.2: RN2.1 65.79,10.21 68,8 CON1.B24
VD14: length 10.9
  Top Layer w0.2: RN1.3 63.29,10.11 65.46,7.94 CON1.B23
VD15: length 10.5
  Top Layer w0.2: RN1.1 61.69,9.31 62.92,8.08 CON1.B22
~CAS0: length 31.6
  Top Layer w0.2: v1(48.39,9.11) 47.68,8.4 CON1.B16 ; U2.99 50.68,29.91 53.59,27.01 53.59,17.11 50.99,14.51 v1(49.19,14.51)
  Bottom Layer w0.2: v1(48.39,9.11) 48.39,11.01 49.19,11.81 v1(49.19,14.51)
~CE_0: length 32.5
  Top Layer w0.2: v1(48.59,15.11) 50.99,15.11 53.19,17.31 53.19,26.81 50.58,29.41 U2.98 ; v1(48.99,8.51) 50.22,7.28 CON1.B17
  Bottom Layer w0.2: v1(48.59,15.11) 49.49,15.11 49.79,14.81 49.79,11.81 48.99,11.01 v1(48.99,8.51)
~DTACK: length 35.2
  Top Layer w0.2: 57.84,12.16 56.99,13.01 v1(56.99,20.51) ; v1(47.99,27.41) 47.99,27.41 U2.94 ; 57.84,9.8 CON1.B20
  Bottom Layer w0.2: v1(47.99,27.41) 48.89,28.31 55.09,28.31 58.19,25.21 58.19,21.31 57.39,20.51 v1(56.99,20.51) ; 57.84,12.16 57.84,9.8
  vias: v1(57.84,12.01) v1(57.84,9.81)
~FCE: length 52.5
  Top Layer w0.2: U2.31 35.09,27.91 35.39,28.21 v1(35.79,28.21) ; v1(61.19,19.81) 61.19,20.11 62.19,21.11 62.19,23.91 62.39,24.11 v1(62.39,24.51) ; U8.32 76.99,19.61 v1(76.79,19.81)
  Bottom Layer w0.2: v1(35.79,28.21) 36.19,28.21 36.69,28.71 55.29,28.71 59.49,24.51 v1(62.39,24.51) ; v1(76.79,19.81) v1(61.19,19.81)
~FWE: length 34.7
  Top Layer w0.2: v1(36.49,14.41) 36.89,14.41 38.59,12.71 51.59,12.71 55.19,16.31 55.19,23.71 57.09,25.61 U8.13 ; U2.54 37.18,15.62 v1(37.29,15.51)
  Bottom Layer w0.2: v1(36.49,14.41) 36.49,14.71 v1(37.29,15.51)
~LWR: length 43
  Top Layer w0.2: v1(45.99,18.01) 45.68,17.7 U2.71 ; CON1.B28 78.16,9.44 v1(77.69,9.91)
  Bottom Layer w0.2: v1(77.69,9.91) 77.39,9.91 77.09,10.21 77.09,11.61 75.99,12.71 68.39,12.71 67.59,13.51 52.29,13.51 48.09,17.71 46.69,17.71 46.39,18.01 v1(45.99,18.01)
~MOE: length 85.6
  Top Layer w0.2: v1(74.89,38.81) 72.39,41.31 67.89,41.31 67.15,42.04 U7.22 67.15,46.27 v1(67.19,46.31) ; v1(79.19,20.91) 78.89,20.61 U8.34 ; v1(31.49,27.81) 32.09,28.41 U2.30
  Bottom Layer w0.2: v1(31.49,27.81) 31.69,28.01 31.69,34.91 44.29,47.51 65.99,47.51 v1(67.19,46.31) ; v1(79.19,20.91) 79.19,34.51 v1(74.89,38.81)
~RCE: length 55.7
  Top Layer w0.2: v1(31.09,28.51) 31.59,28.51 31.99,28.91 U2.29 ; U7.20 69.69,46.3 v1(69.69,46.31)
  Bottom Layer w0.2: v1(31.09,28.51) 31.09,34.91 44.09,47.91 68.09,47.91 v1(69.69,46.31)
~RWE: length 46.1
  Top Layer w0.2: U2.32 32.09,27.41 v1(31.69,27.01) ; U7.27 60.8,46.29 v1(60.79,46.31)
  Bottom Layer w0.2: v1(60.79,46.31) 59.99,47.11 44.49,47.11 32.09,34.71 32.09,27.41 v1(31.69,27.01)
~TIME: length 48.4
  Top Layer w0.2: U2.76 50.39,18.41 51.39,19.41 v1(51.39,20.71) ; CON1.B31 85.78,9.92 81.69,14.01 v1(79.49,14.01)
  Bottom Layer w0.2: v1(79.49,14.01) 79.49,14.41 76.49,17.41 75.69,17.41 75.19,17.91 54.19,17.91 v1(51.39,20.71)
~VRES: length 43.6
  Top Layer w0.2: v1(47.19,18.41) 47.68,17.92 U2.75 ; v1(77.69,10.71) 77.19,10.71 76.79,10.31 76.79,8.61 76.19,8.01 76.19,4.94 CON1.B27
  Bottom Layer w0.2: v1(77.69,10.71) 77.69,11.61 76.19,13.11 68.59,13.11 67.79,13.91 52.49,13.91 47.99,18.41 v1(47.19,18.41)
$1N2516: length 2.2
  Top Layer w0.2: R4.1 43.68,15.44 U2.67
$1N2517: length 3.9
  Top Layer w0.2: U2.68 44.18,15.82 44.39,15.61 44.79,15.61 45.22,15.18 R4.2 46.48,14.76 C7.2

## Copper pours and planes (outline as drawn; the poured copper is in the pictures)
+3V3 on Top Layer: 39.18,32.11 41.68,32.11 41.68,26.62 41.69,26.61 43.09,26.61 43.09,27.71 43.18,27.8 43.18,32.11 46.68,32.11 46.68,30.6 45.89,29.81 45.89,21.61 45.18,20.9 45.18,16.71 43.18,16.71 43.18,21.61 37.26,21.61 37.26,28.48 39.18,30.4
+5V on Bottom Layer: 11.1,7.72 13.13,7.72 13.13,6.99 11.1,6.99
+5V on Bottom Layer: 84.76,7.72 86.79,7.72 86.79,6.99 84.76,6.99
GND on Top Layer: -0.81,62.08 99.01,62.08 99.01,8.2 -0.81,8.2
GND on Top Layer: 87.3,7.72 89.33,7.72 89.33,6.99 87.3,6.99
GND on Bottom Layer: 8.56,8.26 10.59,8.26 10.59,6.99 8.56,6.99
GND on Bottom Layer: -1.52,62.18 99.36,62.18 99.36,8.2 -1.52,8.2
GND on Bottom Layer: 51.74,8.26 53.77,8.26 53.77,6.99 51.74,6.99
GND on Bottom Layer: 87.3,8.26 89.33,8.26 89.33,6.99 87.3,6.99
(no net) on Top Layer: 59.36,7.72 61.39,7.72 61.39,6.99 59.36,6.99
(no net) on Top Layer: 41.58,7.72 43.61,7.72 43.61,6.99 41.58,6.99
(no net) on Top Layer: 72.06,7.72 74.09,7.72 74.09,6.99 72.06,6.99
(no net) on Top Layer: 51.74,7.72 53.77,7.72 53.77,6.99 51.74,6.99
(no net) on Top Layer: 36.5,7.72 38.53,7.72 38.53,6.99 36.5,6.99
(no net) on Top Layer: 11.1,7.72 13.13,7.72 13.13,6.99 11.1,6.99
(no net) on Top Layer: 79.68,7.72 81.71,7.72 81.71,6.99 79.68,6.99
(no net) on Top Layer: 39.04,7.72 41.07,7.72 41.07,6.99 39.04,6.99
(no net) on Top Layer: 82.22,7.72 84.25,7.72 84.25,6.99 82.22,6.99
(no net) on Top Layer: 44.12,7.72 46.15,7.72 46.15,6.99 44.12,6.99
(no net) on Top Layer: 54.28,7.72 56.31,7.72 56.31,6.99 54.28,6.99
(no net) on Top Layer: 8.56,7.72 10.59,7.72 10.59,6.99 8.56,6.99
(no net) on Top Layer: 13.64,7.72 15.67,7.72 15.67,6.99 13.64,6.99
VA1 on Bottom Layer: 49.2,7.72 51.23,7.72 51.23,6.99 49.2,6.99
VA2 on Bottom Layer: 44.12,7.72 46.15,7.72 46.15,6.99 44.12,6.99
VA3 on Bottom Layer: 39.04,7.72 41.07,7.72 41.07,6.99 39.04,6.99
VA4 on Bottom Layer: 33.96,7.72 35.99,7.72 35.99,6.99 33.96,6.99
VA5 on Bottom Layer: 28.88,7.72 30.91,7.72 30.91,6.99 28.88,6.99
VA6 on Bottom Layer: 23.8,7.72 25.83,7.72 25.83,6.99 23.8,6.99
VA7 on Bottom Layer: 18.72,7.72 20.75,7.72 20.75,6.99 18.72,6.99
VA8 on Bottom Layer: 13.64,7.72 15.67,7.72 15.67,6.99 13.64,6.99
VA9 on Top Layer: 16.18,7.72 18.21,7.72 18.21,6.99 16.18,6.99
VA10 on Top Layer: 18.72,7.72 20.75,7.72 20.75,6.99 18.72,6.99
VA11 on Bottom Layer: 16.18,7.72 18.21,7.72 18.21,6.99 16.18,6.99
VA12 on Bottom Layer: 21.26,7.72 23.29,7.72 23.29,6.99 21.26,6.99
VA13 on Bottom Layer: 26.34,7.72 28.37,7.72 28.37,6.99 26.34,6.99
VA14 on Bottom Layer: 31.42,7.72 33.45,7.72 33.45,6.99 31.42,6.99
VA15 on Bottom Layer: 36.5,7.72 38.53,7.72 38.53,6.99 36.5,6.99
VA16 on Bottom Layer: 41.58,7.72 43.61,7.72 43.61,6.99 41.58,6.99
VA17 on Bottom Layer: 46.66,7.72 48.69,7.72 48.69,6.99 46.66,6.99
VA18 on Top Layer: 21.26,7.72 23.29,7.72 23.29,6.99 21.26,6.99
VA19 on Top Layer: 23.8,7.72 25.83,7.72 25.83,6.99 23.8,6.99
VA20 on Top Layer: 26.34,7.72 28.37,7.72 28.37,6.99 26.34,6.99
VA21 on Top Layer: 28.88,7.72 30.91,7.72 30.91,6.99 28.88,6.99
VA22 on Top Layer: 31.42,7.72 33.45,7.72 33.45,6.99 31.42,6.99
VA23 on Top Layer: 33.96,7.72 35.99,7.72 35.99,6.99 33.96,6.99
VD0 on Bottom Layer: 56.82,7.72 58.85,7.72 58.85,6.99 56.82,6.99
VD1 on Bottom Layer: 64.44,7.72 66.47,7.72 66.47,6.99 64.44,6.99
VD2 on Bottom Layer: 72.06,7.72 74.09,7.72 74.09,6.99 72.06,6.99
VD3 on Bottom Layer: 79.68,7.72 81.71,7.72 81.71,6.99 79.68,6.99
VD4 on Bottom Layer: 77.14,7.72 79.17,7.72 79.17,6.99 77.14,6.99
VD5 on Bottom Layer: 69.52,7.72 71.55,7.72 71.55,6.99 69.52,6.99
VD6 on Bottom Layer: 61.9,7.72 63.93,7.72 63.93,6.99 61.9,6.99
VD7 on Bottom Layer: 54.28,7.72 56.31,7.72 56.31,6.99 54.28,6.99
VD8 on Bottom Layer: 59.36,7.72 61.39,7.72 61.39,6.99 59.36,6.99
VD9 on Bottom Layer: 66.98,7.72 69.01,7.72 69.01,6.99 66.98,6.99
VD10 on Bottom Layer: 74.6,7.72 76.63,7.72 76.63,6.99 74.6,6.99
VD11 on Bottom Layer: 82.22,7.72 84.25,7.72 84.25,6.99 82.22,6.99
VD12 on Top Layer: 69.52,7.72 71.55,7.72 71.55,6.99 69.52,6.99
VD13 on Top Layer: 66.98,7.72 69.01,7.72 69.01,6.99 66.98,6.99
VD14 on Top Layer: 64.44,7.72 66.47,7.72 66.47,6.99 64.44,6.99
VD15 on Top Layer: 61.9,7.72 63.93,7.72 63.93,6.99 61.9,6.99
~CAS0 on Top Layer: 46.66,7.72 48.69,7.72 48.69,6.99 46.66,6.99
~CE_0 on Top Layer: 49.2,7.72 51.23,7.72 51.23,6.99 49.2,6.99
~DTACK on Top Layer: 56.82,7.72 58.85,7.72 58.85,6.99 56.82,6.99
~LWR on Top Layer: 77.14,7.72 79.17,7.72 79.17,6.99 77.14,6.99
~TIME on Top Layer: 84.76,7.72 86.79,7.72 86.79,6.99 84.76,6.99
~VRES on Top Layer: 74.6,7.72 76.63,7.72 76.63,6.99 74.6,6.99

## Text on the board
Bottom Silkscreen Layer: MD/Genesis/32X Reproduction cartridge / PCB design by Stargazer (rev.0)
Top Silkscreen Layer: 3V Parallel NOR Flash | TSSOP-56 | TSSOP-48 | BYTESWAPPED ROM | SMD_3128_BM_3
